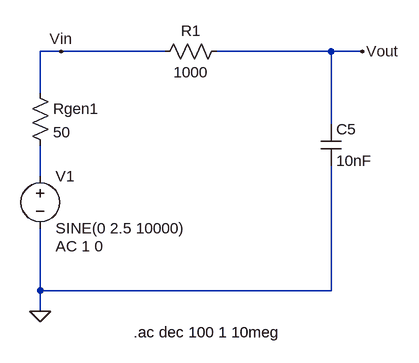
[diagram p0: schematic series_RC_filter.asc]
series_RC_filter.asc, the LTspice schematic file:
Version 4
SHEET 1 880 680
WIRE 0 -80 -32 -80
WIRE 160 -80 0 -80
WIRE 416 -80 240 -80
WIRE 464 -80 416 -80
WIRE -32 -16 -32 -80
WIRE 416 32 416 -80
WIRE -32 112 -32 64
WIRE -32 288 -32 192
WIRE 416 288 416 96
WIRE 416 288 -32 288
WIRE -32 320 -32 288
FLAG -32 320 0
FLAG 464 -80 Vout
FLAG 0 -80 Vin
SYMBOL voltage -32 96 R0
WINDOW 123 24 124 Left 2
WINDOW 39 0 0 Left 0
SYMATTR InstName V1
SYMATTR Value SINE(0 2.5 10000)
SYMATTR Value2 AC 1 0
SYMBOL res -48 -32 R0
SYMATTR InstName Rgen1
SYMATTR Value 50
SYMBOL res 256 -96 R90
WINDOW 0 0 56 VBottom 2
WINDOW 3 32 56 VTop 2
SYMATTR InstName R1
SYMATTR Value 1000
SYMBOL cap 400 32 R0
SYMATTR InstName C5
SYMATTR Value 10nF
TEXT 112 352 Left 2 !.ac dec 100 1 10meg

The netlist it stands for:
* series_RC_filter.asc
V1 N001 0 SINE(0 2.5 10000) AC 1 0
Rgen1 Vin N001 50
R1 Vout Vin 1000
C5 Vout 0 10nF
.ac dec 100 1 10meg
.backanno
.end